# EAGLE design drehgeber_v3 (EAGLE 5.03)
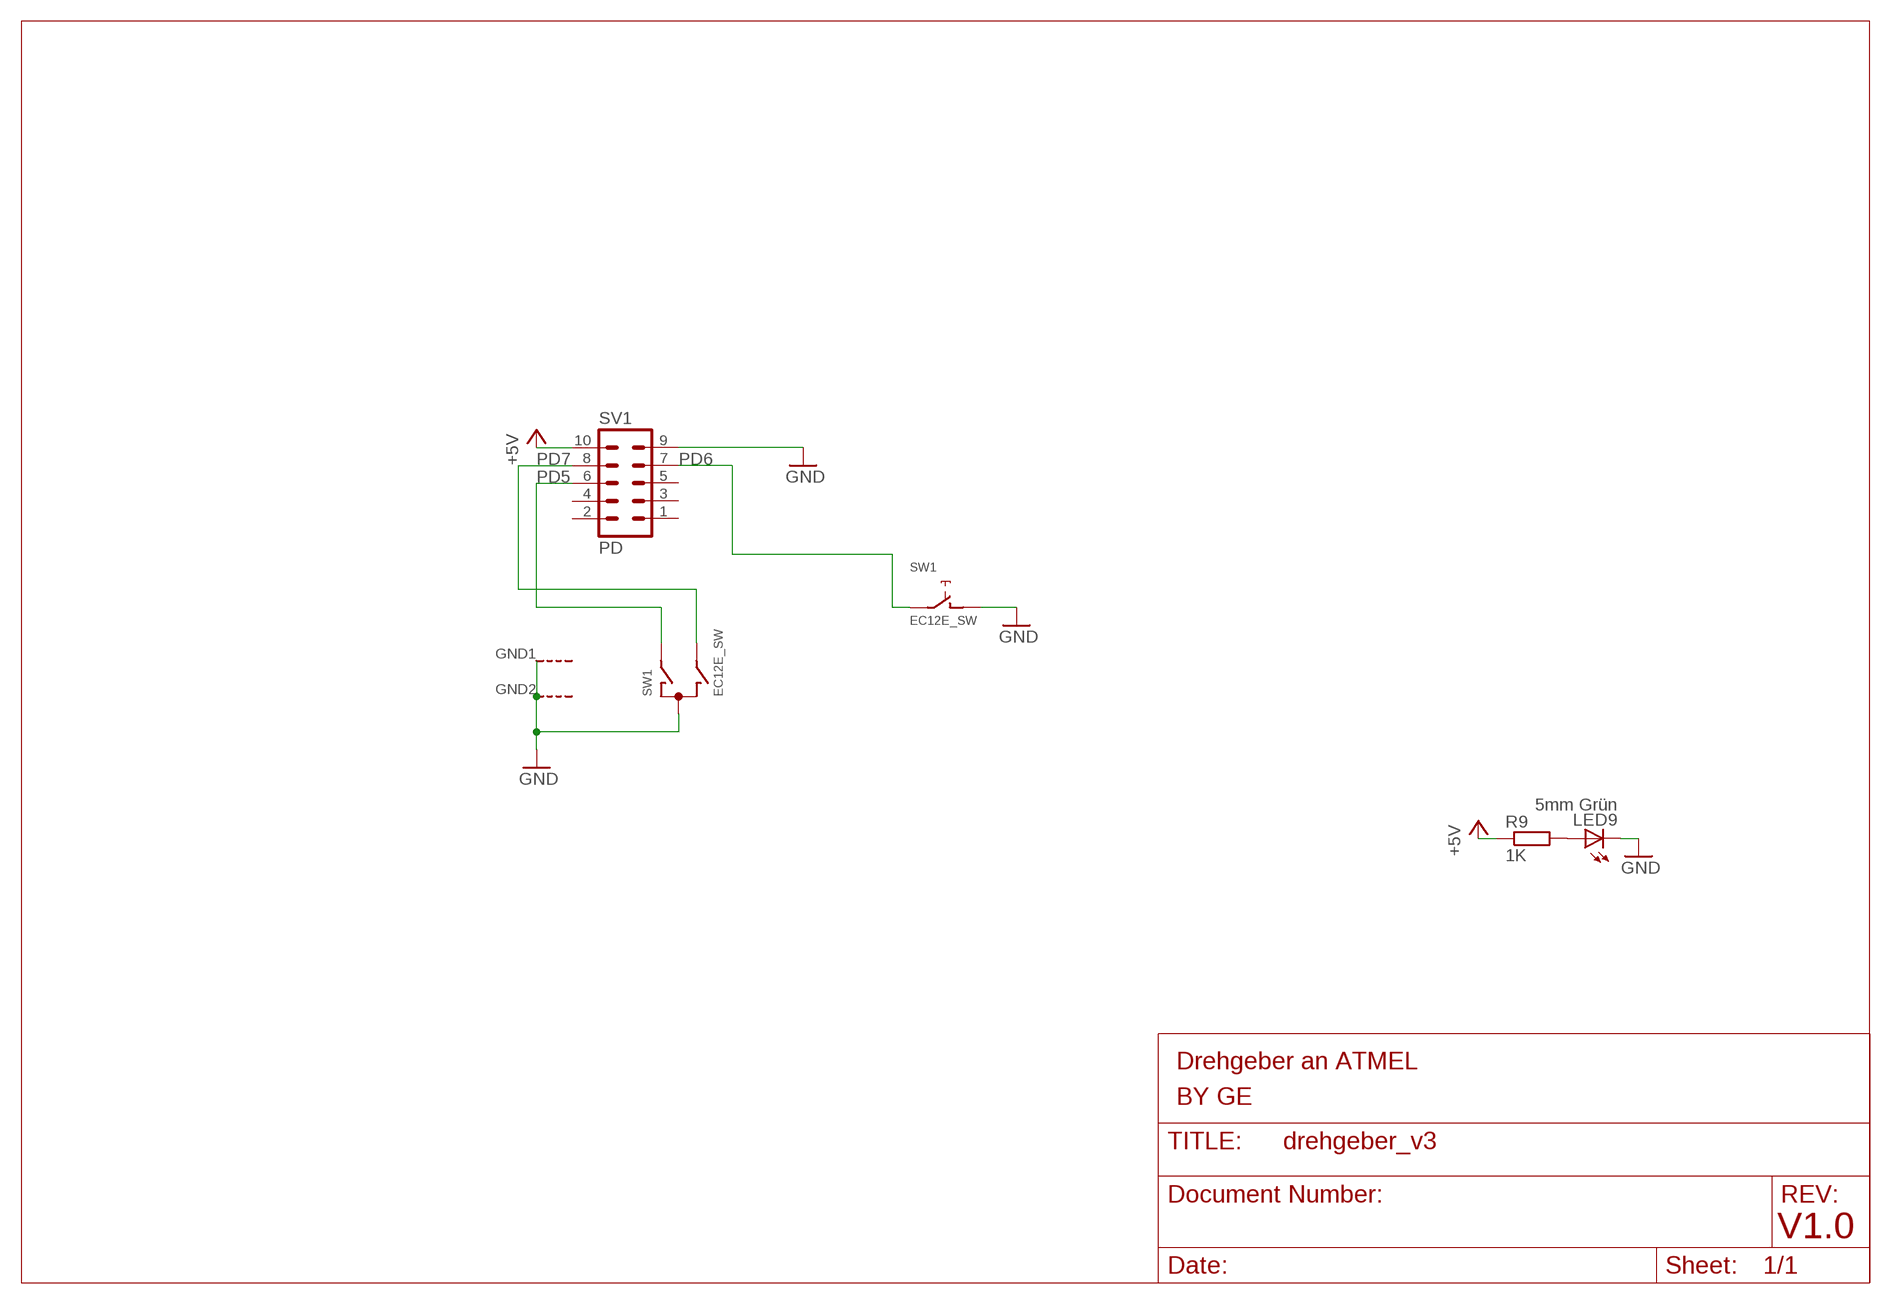
[diagram p0: schematic, sheet 1]

## Parts
LED9  5mm Grün  LED3MM  [LED3MM]
R9  1K  R-EU_0204/2V  [0204V]
SV1  PD  ML10  [ML10]
SW1  EC12E_SW  [ALPS_EC12E_SW]

## Nets
+5V: R9.1 SV1.10
GND: LED9.K(C) SV1.9 SW1.C SW1.D SW1.GND1(G) SW1.GND2(G)
N$25: LED9.A R9.2
PD5: SV1.6 SW1.A
PD6: SV1.7 SW1.E
PD7: SV1.8 SW1.B
Unconnected: SV1.1 SV1.2 SV1.3 SV1.4 SV1.5

## Notes on the sheet
- Drehgeber an ATMEL
- BY GE
- V1.0

## Library data of the parts
LED9 = led:LED: LED OSRAM: - CHIPLED LG R971, LG N971, LY N971, LG Q971, LY Q971, LO R971, LY R971 LH N974, LH R974 LS Q976, LO Q976, LY Q976 LO Q996 - Hyper CHIPLED LW Q18S LB Q993, LB Q99A, LB R99A - SideLED LS A670, LO A670, LY A670, LG A670, LP A670 LB A673, LV A673, LT A673, LW A673 LH A674 LY A675 LS A676, LA A676, LO A676, LY A676, LW A676 LS A679, LY A679, LG A679 - Hyper Micro SIDELED® LS Y876, LA Y876, LO Y876, LY Y876 LT Y87S - SmartLED LW L88C, LW L88S LB L89C, LB L89S, LG L890 LS L89K, LO L89K, LY L89K LS L896, LA L896, LO L896, LY L896 - TOPLED LS T670, LO T670, LY T670, LG T670, LP T670 LSG T670, LSP T670, LSY T670, LOP T670, LYG T670 LG T671, LOG T671, LSG T671 LB T673, LV T673, LT T673, LW T673 LH T674 LS T676, LA T676, LO T676, LY T676, LB T676, LH T676, LSB T676, LW T676 LB T67C, LV T67C, LT T67C, LS T67K, LO T67K, LY T67K, LW E67C LS E67B, LA E67B, LO E67B, LY E67B, LB E67C, LV E67C, LT E67C LW T67C LS T679, LY T679, LG T679 LS T770, LO T770, LY T770, LG T770, LP T770 LB T773, LV T773, LT T773, LW T773 LH T774 LS E675, LA E675, LY E675, LS T675 LS T776, LA T776, LO T776, LY T776, LB T776 LHGB T686 LT T68C, LB T68C - Hyper Mini TOPLED® LB M676 - Mini TOPLED Santana® LG M470 LS M47K, LO M47K, LY M47K Source: http://www.osram.convergy.de LUXEON: - LUMILED® LXK2-PW12-R00, LXK2-PW12-S00, LXK2-PW14-U00, LXK2-PW14-V00 LXK2-PM12-R00, LXK2-PM12-S00, LXK2-PM14-U00 LXK2-PE12-Q00, LXK2-PE12-R00, LXK2-PE12-S00, LXK2-PE14-T00, LXK2-PE14-U00 LXK2-PB12-K00, LXK2-PB12-L00, LXK2-PB12-M00, LXK2-PB14-N00, LXK2-PB14-P00, LXK2-PB14-Q00 LXK2-PR12-L00, LXK2-PR12-M00, LXK2-PR14-Q00, LXK2-PR14-R00 LXK2-PD12-Q00, LXK2-PD12-R00, LXK2-PD12-S00 LXK2-PH12-R00, LXK2-PH12-S00 LXK2-PL12-P00, LXK2-PL12-Q00, LXK2-PL12-R00 Source: www.luxeon.com KINGBRIGHT: KA-3528ASYC Source: www.kingbright.com
R9 = rcl:R-EU_: RESISTOR, European symbol
SV1 = con-harting-ml:ML10: HARTING
SW1 = switch-alps:EC12E_SW: ALPS rotary Encoder EC12E series with switch

## Board
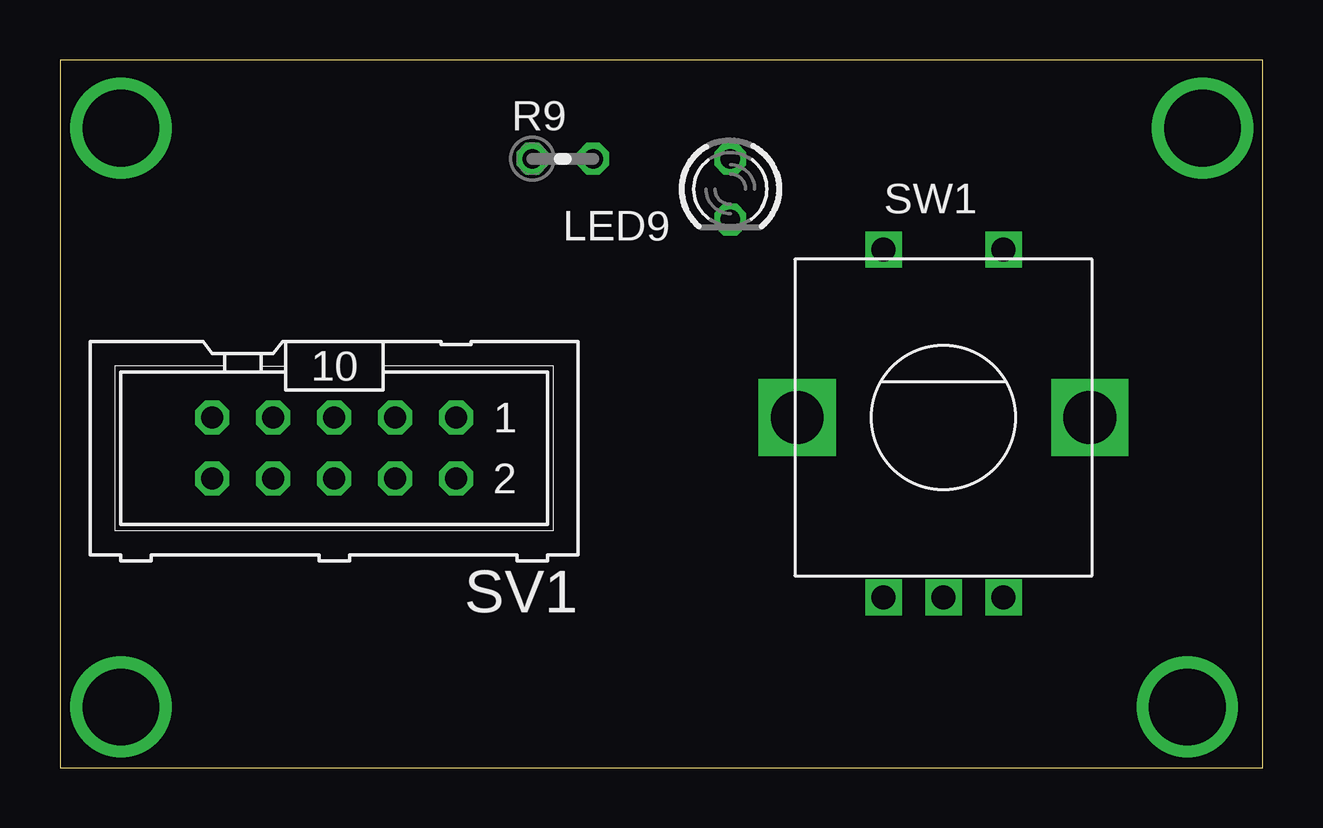
[diagram p1: board, top side]
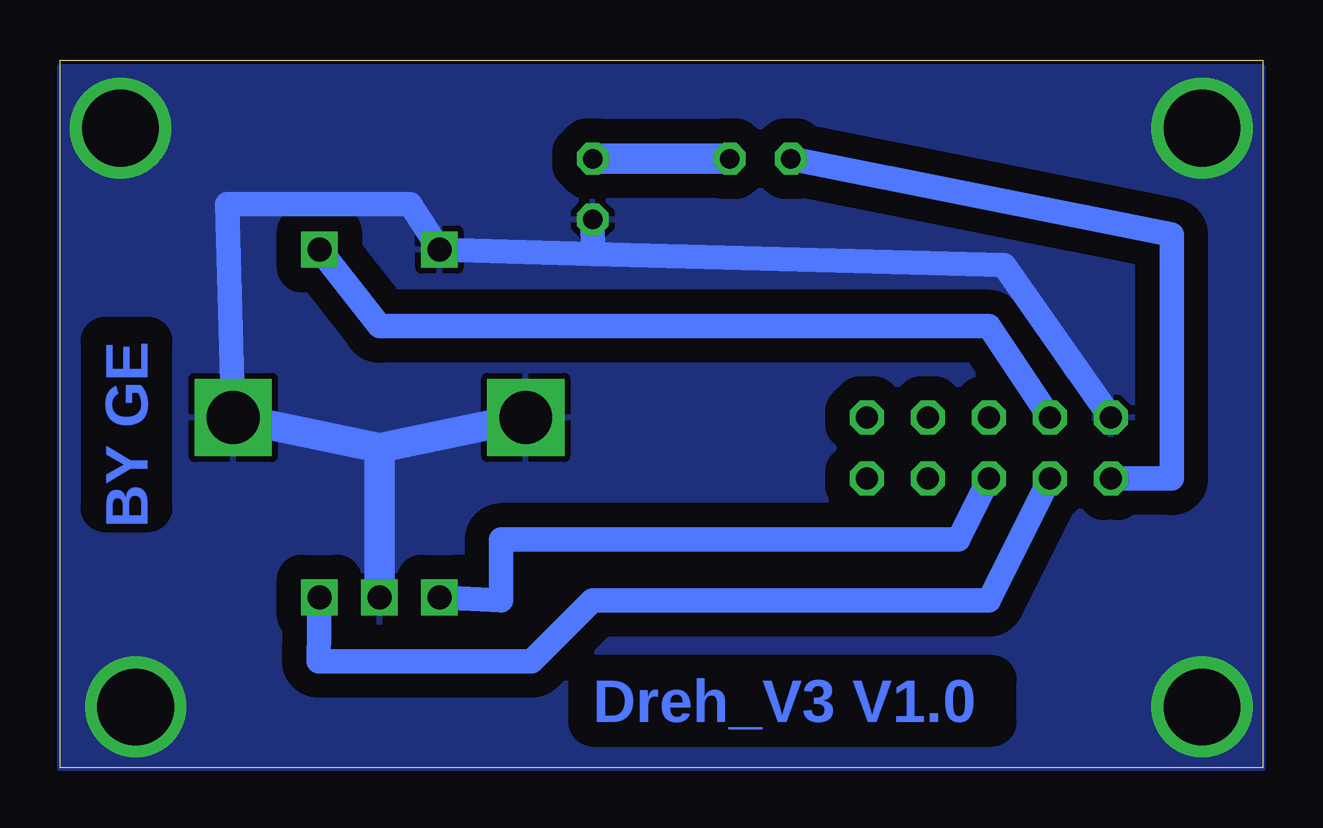
[diagram p2: board, bottom side, seen from below]

Size 50.15 x 29.52 mm. Coordinates in mm from the lower left corner, seen from the top.
Outline: 0,0 50.15,0 50.15,29.52 0,29.52 0,0
Copper layers (1*16): Top 0.035mm / dielectric 1.5mm / Bottom 0.035mm
Design rules "0.35mm": minimum track width 10mil, minimum drill 24mil, track to track 0.35mm, track to pad 0.35mm, pad to pad 0.35mm, via to via 0.35mm, smd to smd 0.35mm, copper to edge 0mil, drill to drill 8mil, minimum pad ring 10mil, minimum via ring 8mil, stop-mask expansion 4mil, vias tented up to drill 0mil, thermal gap 10mil

### Footprints (pad centres in the part's own frame; a part is rotated, then mirrored left to right if it is on the bottom)
LED3MM = drill 0.813 octagon: A -1.27,0; K 1.27,0
0204V = drill 0.813 octagon: 1 -1.27,0; 2 1.27,0
ML10 = drill 0.914 octagon: 1 -5.08,-1.27; 2 -5.08,1.27; 3 -2.54,-1.27; 4 -2.54,1.27; 5 0,-1.27; 6 0,1.27; 7 2.54,-1.27; 8 2.54,1.27; 9 5.08,-1.27; 10 5.08,1.27
ALPS_EC12E_SW = drill 1 square: A -2.5,-7.5; B 2.5,-7.5; C 0,-7.5; D -2.5,7; E 2.5,7 | drill 2.2 square: GND1 -6.1,0; GND2 6.1,0

### Placement (x,y rotation side)
LED9  27.94,24.13 270 top
R9  20.95,25.4 0 top
SV1  11.43,13.34 180 top
SW1  36.83,14.61 0 top

### Tracks (layer width: path | path; a pad name or v marks a point on that pad's centre or on a via)
+5V
  Bottom 1.016: R9.1 3.81,22.23 3.81,12.06 SV1.10
GND  (via drill 3.2)
  Bottom 1.016: SV1.9 10.79,20.95 27.93,21.43 | 27.93,21.43 SW1.D 35.56,23.5 43.18,23.5 SW1.GND2 | 27.93,21.43 LED9.K
  Bottom 1.27: 36.83,13.34 SW1.C | SW1.GND2 36.83,13.34 | 36.83,13.34 SW1.GND1
  other vias: 2.54,26.67 2.54,2.54 47.62,26.67 46.99,2.54
  pour Bottom (isolate 1.016): 0,0 0,29.21 50.16,29.21 50.16,0
N$25
  Bottom 1.27: R9.2 LED9.A
PD5
  Bottom 1.016: SW1.A 31.75,6.99 31.75,9.53 12.7,9.53 SV1.6
PD6
  Bottom 1.016: SW1.E 36.83,18.41 11.43,18.41 SV1.7
PD7
  Bottom 1.016: SV1.8 11.43,6.99 27.94,6.99 30.48,4.45 39.37,4.45 SW1.B

### Text on the board
Bottom: BY GE | Dreh_V3 V1.0